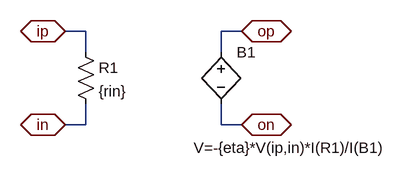
[diagram p0: schematic dcdcrv.asc]
dcdcrv.asc, the LTspice schematic file:
Version 4.1
SHEET 1 880 680
WIRE 80 112 48 112
WIRE 320 112 288 112
WIRE 80 144 80 112
WIRE 288 144 288 112
WIRE 80 256 80 224
WIRE 80 256 48 256
WIRE 288 256 288 224
WIRE 320 256 288 256
FLAG 48 112 ip
IOPIN 48 112 BiDir
FLAG 48 256 in
IOPIN 48 256 BiDir
FLAG 320 112 op
IOPIN 320 112 BiDir
FLAG 320 256 on
IOPIN 320 256 BiDir
SYMBOL bv 288 128 R0
WINDOW 3 -42 163 Left 2
SYMATTR Value V=-{eta}*V(ip,in)*I(R1)/I(B1)
SYMATTR InstName B1
SYMBOL res 64 128 R0
SYMATTR InstName R1
SYMATTR Value {rin}

The netlist it stands for:
* dcdcrv.asc
B1 op on V=-{eta}*V(ip,in)*I(R1)/I(B1)
R1 ip in {rin}
.backanno
.end